# EAGLE design FSKmodem2 (EAGLE 7.1.0)
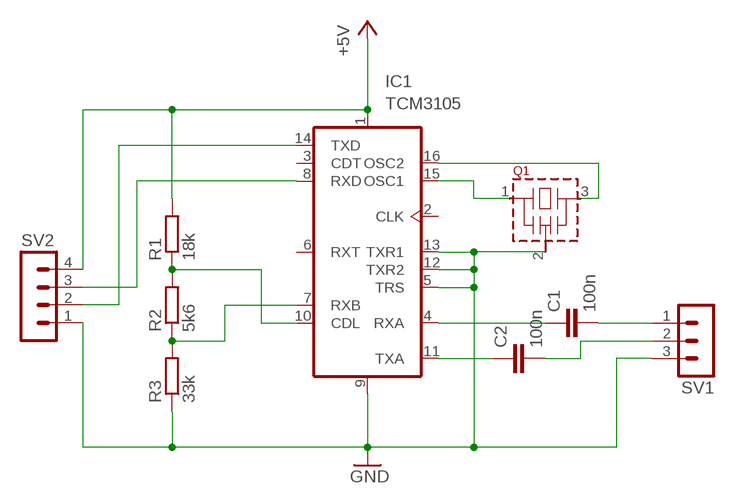
[diagram p0: schematic, sheet 1]

## Parts
C1  100n  C-EU050-024X044  [C050-024X044]
C2  100n  C-EU050-024X044  [C050-024X044]
IC1  TCM3105  [DIL16]
Q1  CSTLS_G  [CSTLS_G8]
R1  18k  R-EU_0204/5  [0204/5]
R2  5k6  R-EU_0204/5  [0204/5]
R3  33k  R-EU_0204/5  [0204/5]
SV1  MA03-1  [MA03-1]
SV2  MA04-1  [MA04-1]

## Nets
+5V: IC1.1(VDD) R1.2 SV2.4
GND: IC1.5(TRS) IC1.9(VSS) IC1.12(TXR2) IC1.13(TXR1) Q1.2(VSS) R3.1 SV1.3 SV2.1
N$1: IC1.10(CDL) R1.1 R2.2
N$2: IC1.15(OSC1) Q1.1
N$3: C2.2 SV1.2
N$4: C1.1 IC1.4(RXA)
N$5: C2.1 IC1.11(TXA)
N$6: C1.2 SV1.1
N$7: IC1.7(RXB) R2.1 R3.2
N$8: IC1.14(TXD) SV2.2
N$9: IC1.8(RXD) SV2.3
N$13: IC1.16(OSC2) Q1.3
Unconnected: IC1.2(CLK) IC1.3(CDT) IC1.6(RXT)

## Library data of the parts
C1 C2 = rcl:C-EU: CAPACITOR, European symbol
IC1 = tcm3105:TCM3105
Q1 = murata-resonators:CSTLS_G: Ceramic resonator 2.00 to 10.00 MHz
R1-R3 = rcl:R-EU_: RESISTOR, European symbol
SV1 = con-lstb:MA03-1: PIN HEADER; OC_FARNELL: unknown; OC_NEWARK: unknown
SV2 = con-lstb:MA04-1: PIN HEADER; OC_FARNELL: unknown; OC_NEWARK: unknown

## Board
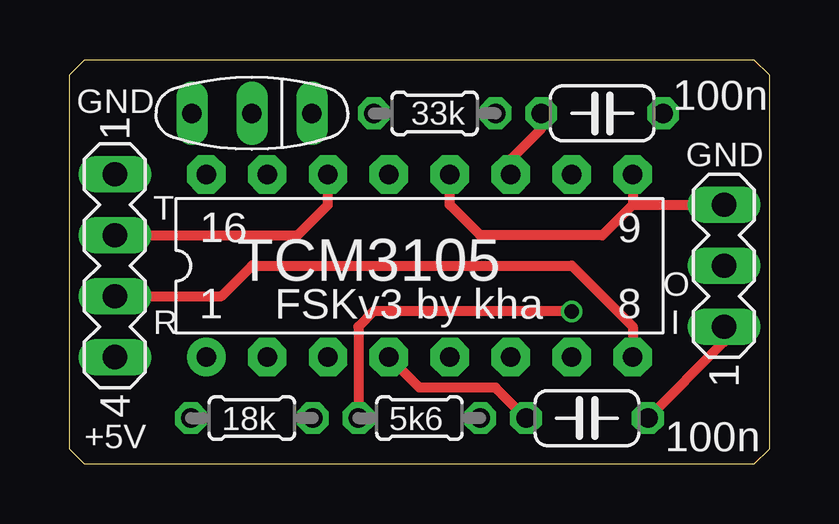
[diagram p1: board, top side]
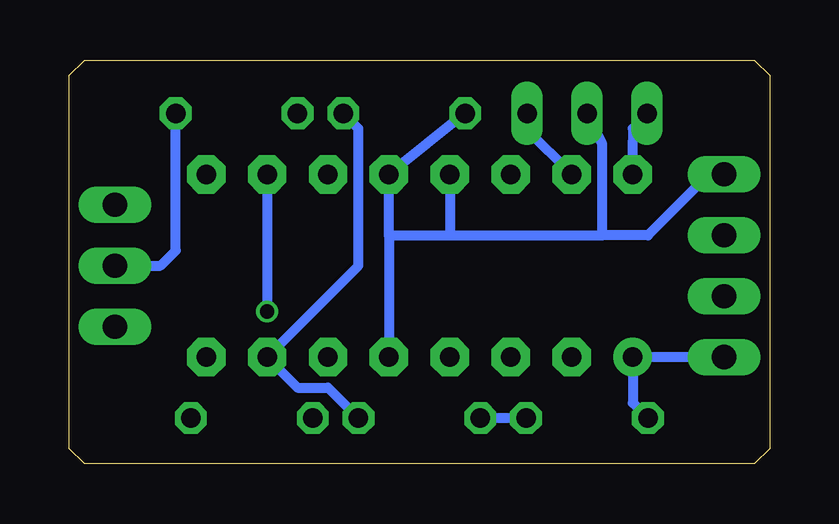
[diagram p2: board, bottom side, seen from below]

Size 29.21 x 16.83 mm. Coordinates in mm from the lower left corner, seen from the top.
Outline: 0.64,0 28.56,0 29.21,0.64 29.21,16.19 28.56,16.82 0.64,16.83 0,16.19 0,0.64 0.64,0
Copper layers (1*16): Top 0.035mm / dielectric 1.5mm / Bottom 0.035mm
Design rules "default": minimum track width 6mil, minimum drill 12mil, track to track 6mil, track to pad 6mil, pad to pad 6mil, via to via 6mil, smd to smd 0mil, copper to edge 10mil, drill to drill 10mil, minimum pad ring 10mil, minimum via ring 6mil, stop-mask expansion 2mil, vias tented up to drill 100mil, thermal gap 10mil

### Footprints (pad centres in the part's own frame; a part is rotated, then mirrored left to right if it is on the bottom)
C050-024X044 = drill 0.813 octagon: 1 -2.54,0; 2 2.54,0
DIL16 = drill 0.813 pad 1.6: 1 -8.89,-3.81 | drill 0.813 pad 1.6 octagon: 2 -6.35,-3.81; 3 -3.81,-3.81; 4 -1.27,-3.81; 5 1.27,-3.81; 6 3.81,-3.81; 7 6.35,-3.81; 8 8.89,-3.81; 9 8.89,3.81; 10 6.35,3.81; 11 3.81,3.81; 12 1.27,3.81; 13 -1.27,3.81; 14 -3.81,3.81; 15 -6.35,3.81; 16 -8.89,3.81
CSTLS_G8 = drill 0.813 long: 1 -2.5,0; 2 0,0; 3 2.5,0
0204/5 = drill 0.813 octagon: 1 -2.54,0; 2 2.54,0
MA03-1 = drill 1.016 long: 1 -2.54,0; 2 0,0; 3 2.54,0
MA04-1 = drill 1.016 long: 1 -3.81,0; 2 -1.27,0; 3 1.27,0; 4 3.81,0

### Placement (x,y rotation side)
C1  21.59,1.91 0 top
C2  22.23,14.61 0 top
IC1  14.61,8.26 0 top
Q1  7.62,14.61 180 top
R1  7.62,1.91 180 top
R2  14.61,1.91 180 top
R3  15.24,14.61 0 top
SV1  27.3,8.26 90 top
SV2  1.91,8.26 270 top

### Tracks (layer width: path | path; a pad name or v marks a point on that pad's centre or on a via)
+5V
  Bottom 0.406: SV2.4 IC1.1 5.71,2.54 R1.2
GND
  Top 0.406: IC1.9 23.5,10.79 | 23.5,10.79 22.23,9.53 17.14,9.53 15.88,10.79 IC1.12 | 23.5,10.79 SV1.3
  Bottom 0.406: SV2.1 2.54,12.06 5.08,9.53 6.99,9.53 | 6.99,9.53 6.99,13.34 Q1.2 | 15.88,9.53 13.34,9.53 | 13.34,9.53 6.99,9.53 | 15.88,9.53 IC1.12 R3.1 | 15.88,9.53 IC1.5 | IC1.13 13.34,9.53
N$1  (via drill 0.6)
  Top 0.406: v20.95,6.35 12.7,6.35 12.06,5.71 R2.2
  Bottom 0.406: R1.1 R2.2 | IC1.10 v20.95,6.35
N$2
  Bottom 0.406: Q1.1 10.12,14.01 10.16,13.97 IC1.15
N$3
  Bottom 0.406: SV1.2 25.4,8.26 24.77,8.89 C2.2
N$4
  Top 0.406: C1.1 17.78,3.17 14.61,3.17 IC1.4
N$5
  Top 0.406: IC1.11 18.41,12.7 19.68,13.97 C2.1
N$6
  Top 0.406: C1.2 27.3,5.08 SV1.1
N$7
  Bottom 0.406: R3.2 17.14,13.97 17.14,8.26 IC1.7 19.68,3.17 18.41,3.17 R2.1
N$8
  Top 0.406: SV2.2 9.53,9.53 10.79,10.79 IC1.14
N$9
  Top 0.406: SV2.3 6.35,6.99 7.62,8.26 20.95,8.26 23.5,5.71 IC1.8
N$13
  Bottom 0.406: Q1.3 5.12,14.56 5.71,13.97 5.75,12.11 IC1.16

### Text on the board
tNames: GND | GND | T | TCM3105 | O | FSKv3 by kha | R | I | +5V